# EAGLE design esp8266-adapter (EAGLE 7.5.0)
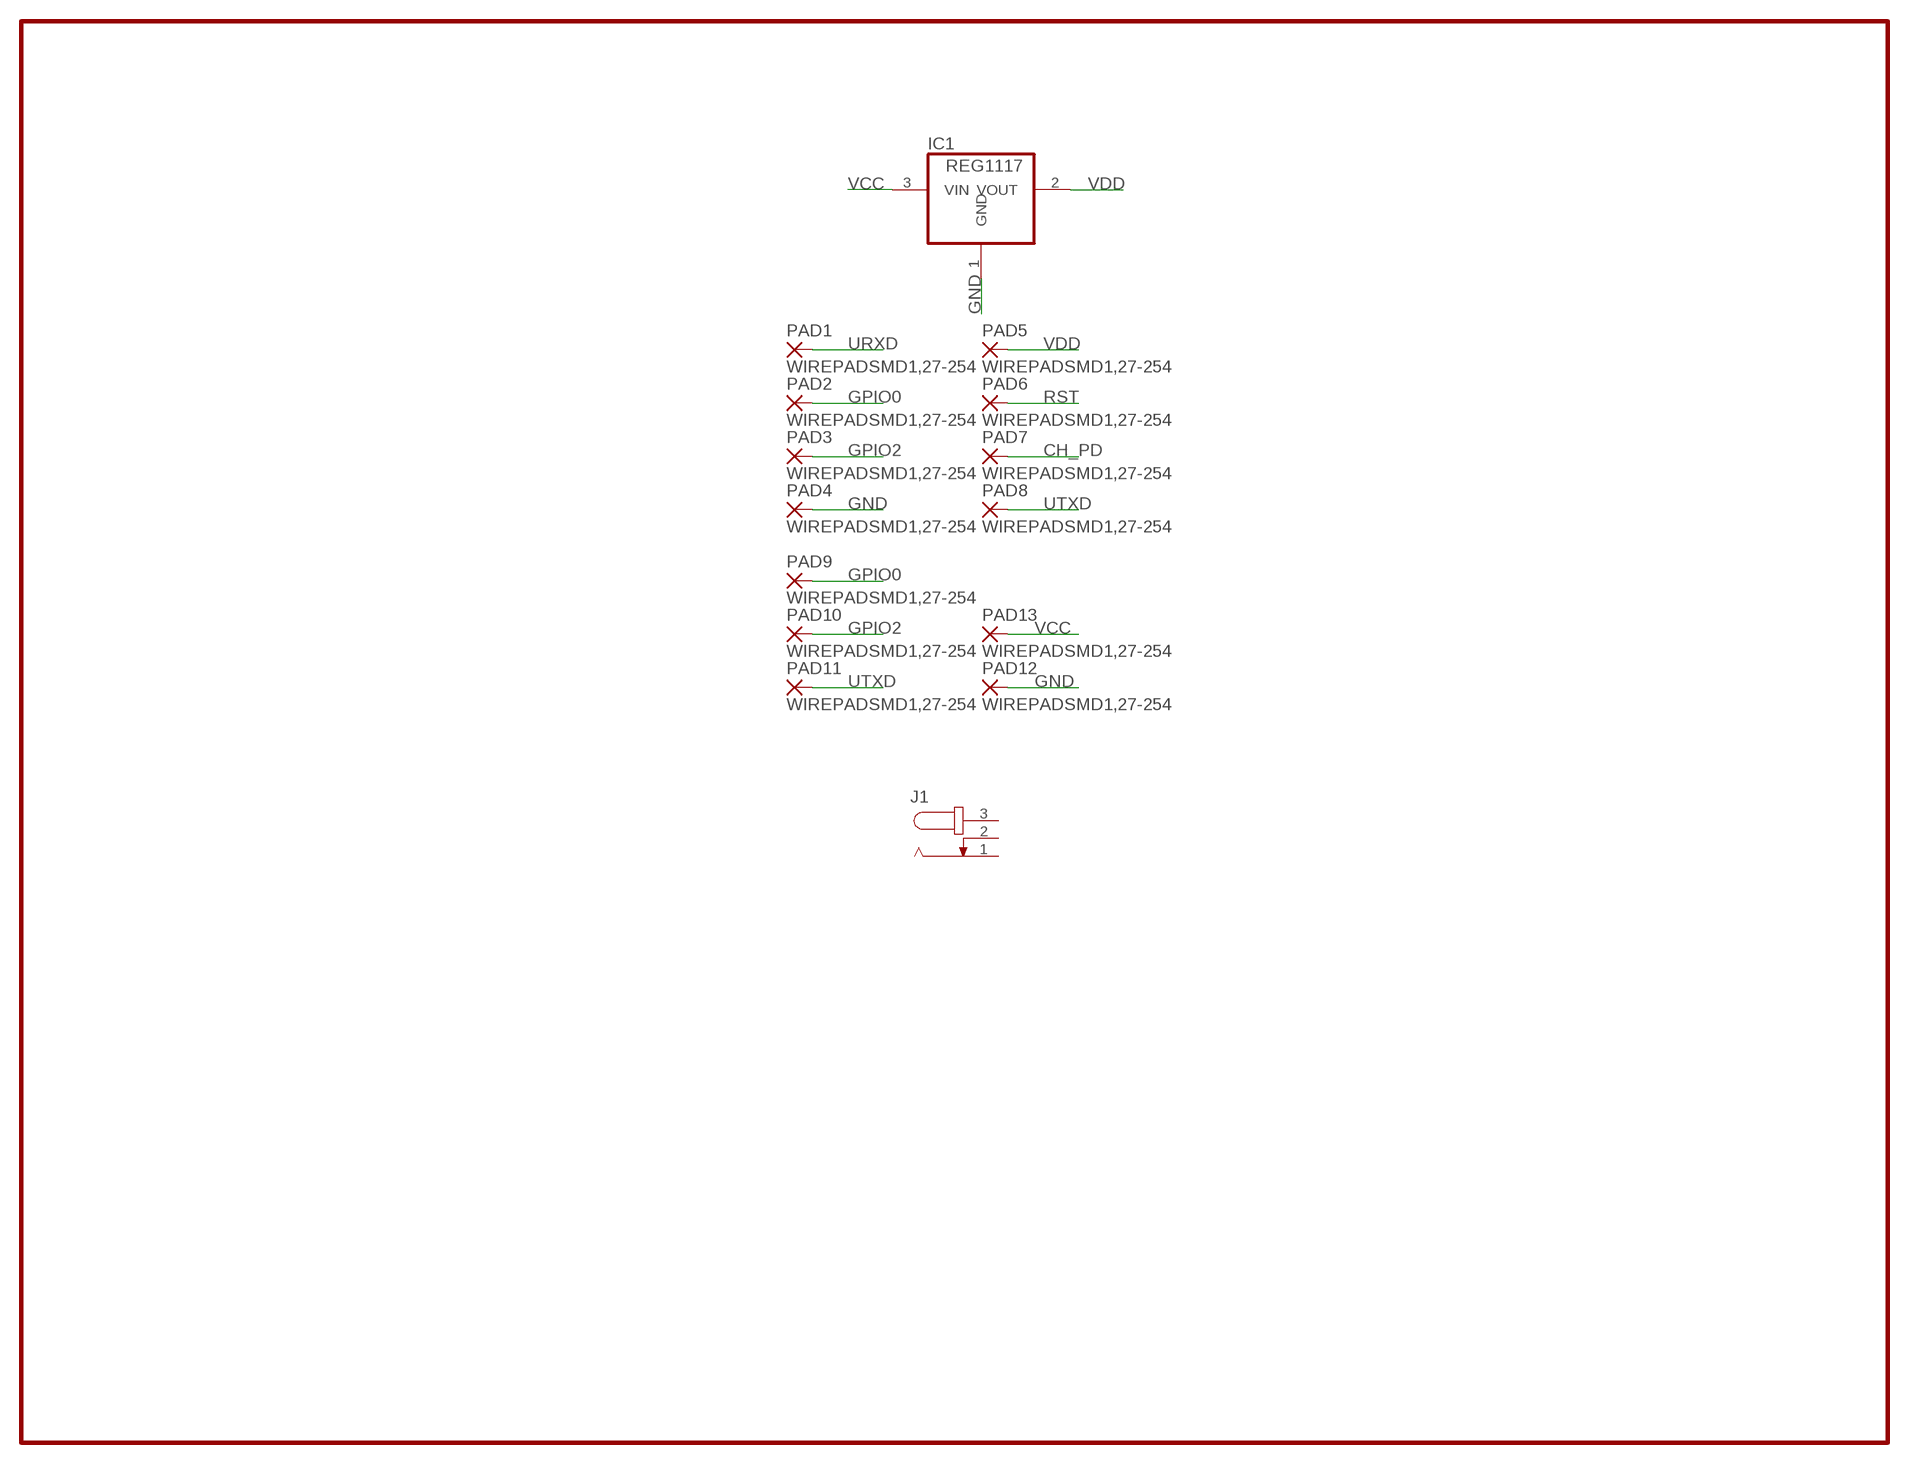
[diagram p0: schematic, sheet 1]

## Parts
IC1  REG1117  [SOT223]
J1  JACK-PLUG0  [SPC4077]
PAD1  WIREPADSMD1,27-254  [SMD1,27-2,54]
PAD2  WIREPADSMD1,27-254  [SMD1,27-2,54]
PAD3  WIREPADSMD1,27-254  [SMD1,27-2,54]
PAD4  WIREPADSMD1,27-254  [SMD1,27-2,54]
PAD5  WIREPADSMD1,27-254  [SMD1,27-2,54]
PAD6  WIREPADSMD1,27-254  [SMD1,27-2,54]
PAD7  WIREPADSMD1,27-254  [SMD1,27-2,54]
PAD8  WIREPADSMD1,27-254  [SMD1,27-2,54]
PAD9  WIREPADSMD1,27-254  [SMD1,27-2,54]
PAD10  WIREPADSMD1,27-254  [SMD1,27-2,54]
PAD11  WIREPADSMD1,27-254  [SMD1,27-2,54]
PAD12  WIREPADSMD1,27-254  [SMD1,27-2,54]
PAD13  WIREPADSMD1,27-254  [SMD1,27-2,54]

## Nets
CH_PD: PAD7.1(P)
GND: IC1.1(GND) PAD4.1(P) PAD12.1(P)
GPIO0: PAD2.1(P) PAD9.1(P)
GPIO2: PAD3.1(P) PAD10.1(P)
RST: PAD6.1(P)
URXD: PAD1.1(P)
UTXD: PAD8.1(P) PAD11.1(P)
VCC: IC1.3(VIN) PAD13.1(P)
VDD: IC1.2(VOUT) PAD5.1(P)
Unconnected: J1.1 J1.2 J1.3

## Library data of the parts
IC1 = burr-brown:REG1117: 800mA and 1A Low Dropout (LDO) Positive Regulator 1.8V, 2.5V, 2.85V, 3.3V, 5V, and Adj; MPN: REG1117; OC_FARNELL: 1097566; OC_NEWARK: 14P6981
J1 = con-jack:JACK-PLUG: DC POWER JACK Power Jack, DC, Right Angle, Through Hole, Rated 5A at 16VDC, PC Terminals Distributor: Farnell (www.Farnell.de) Drawing: 84N1161.pdf / 84N1162.pdf Manufacturer: SPC Technology (www.spctechnology.com) Type: SPC4077 / SPC 4078; OC_FARNELL: unknown; OC_NEWARK: unknown
PAD1-PAD13 = wirepad:WIREPAD: Wire PAD connect wire on PCB

## Board
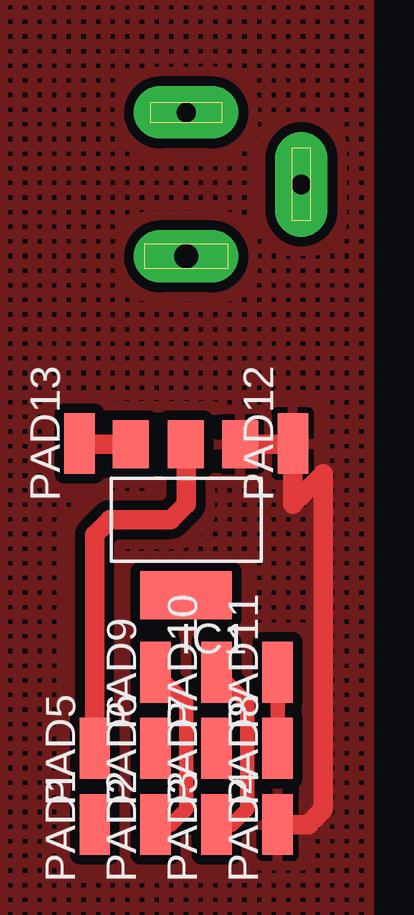
[diagram p1: board, top side]
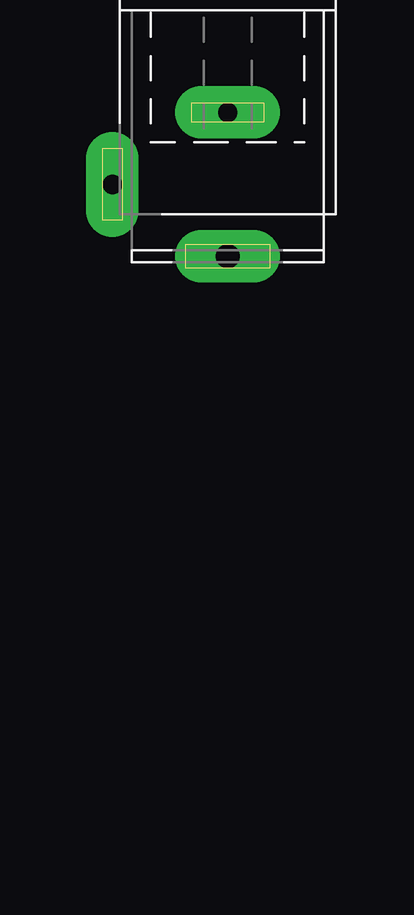
[diagram p2: board, bottom side, seen from below]

No outline drawn. Coordinates in mm, seen from the top.
Copper layers (1*16): Top 0.035mm / dielectric 1.5mm / Bottom 0.035mm
Design rules "default": minimum track width 10mil, minimum drill 24mil, track to track 8mil, track to pad 8mil, pad to pad 8mil, via to via 8mil, smd to smd 8mil, copper to edge 40mil, drill to drill 8mil, minimum pad ring 10mil, minimum via ring 8mil, stop-mask expansion 4mil, vias tented up to drill 0mil, thermal gap 10mil

### Footprints (pad centres in the part's own frame; a part is rotated, then mirrored left to right if it is on the bottom)
SOT223 = smd 1.499 x 2.007: 1 -2.261,-3.15; 2 0.025,-3.15; 3 2.311,-3.15 | smd 3.81 x 2.007: 4 0,3.15
SPC4077 = drill 0.8 pad 2.184 long: 1 -3,0; 2 0,-4.8 | drill 1 pad 2.184 long: 3 3,0
SMD1,27-2,54 = smd 1.27 x 2.54: 1 0,0

### Placement (x,y rotation side)
IC1  7.62,22.23 180 top
J1  7.62,36.2 270 bottom
PAD1  3.81,9.53 0 top
PAD2  6.35,9.53 0 top
PAD3  8.89,9.53 0 top
PAD4  11.43,9.53 0 top
PAD5  3.81,12.7 0 top
PAD6  6.35,12.7 0 top
PAD7  8.89,12.7 0 top
PAD8  11.43,12.7 0 top
PAD9  6.35,15.88 0 top
PAD10  8.89,15.88 0 top
PAD11  11.43,15.88 0 top
PAD12  12.06,25.4 0 top
PAD13  3.17,25.4 0 top

### Tracks (layer width: path | path; a pad name or v marks a point on that pad's centre or on a via)
GND
  Top 0.813: PAD4.1 12.7,9.53 13.34,10.16 13.34,24.13 12.06,22.86 PAD12.1 12.04,25.38 IC1.1
  pour Top (isolate 0.406, hatched): 0,0 15.24,0 15.24,45.09 0,45.09
GPIO0
  Top 0.61: PAD2.1 6.99,9.53 7.62,10.16 7.62,14.61 PAD9.1
GPIO2
  Top 0.61: PAD3.1 9.53,9.53 10.16,10.16 10.16,14.61 PAD10.1
UTXD
  Top 0.61: PAD8.1 PAD11.1
VCC
  Top 0.813: IC1.3 3.2,25.38 PAD13.1
VDD
  Top 0.813: PAD5.1 3.81,21.59 4.45,22.23 6.99,22.23 7.62,22.86 7.62,25.35 IC1.2